# EAGLE design standalone_1_bit_logic (EAGLE 8.2.1)
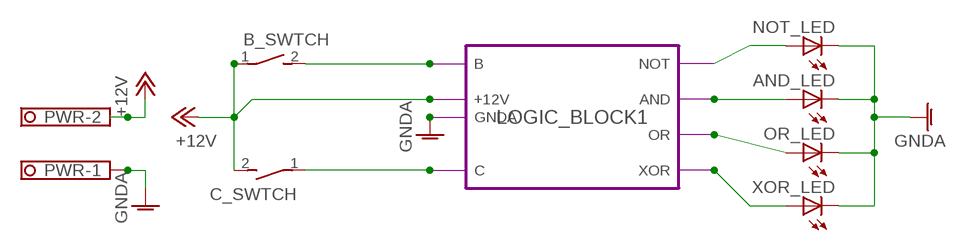
[diagram p0: schematic, sheet 1]

## Parts
AND_LED  LED3MM  [LED3MM]
B_SWTCH  SWTCH_BLCK  [1751248]
C_SWTCH  SWTCH_BLCK  [1751248]
NOT_LED  LED3MM  [LED3MM]
OR_LED  LED3MM  [LED3MM]
PWR  1751248  [1751248]
XOR_LED  LED3MM  [LED3MM]

## Module instances
LOGIC_BLOCK1 = LOGIC_BLOCK

## Nets
+12V: B_SWTCH.1(P) C_SWTCH.2(S) PWR.2 ; port LOGIC_BLOCK1.+12V
AND: AND_LED.A ; port LOGIC_BLOCK1.AND
B: B_SWTCH.2(S) ; port LOGIC_BLOCK1.B
C: C_SWTCH.1(P) ; port LOGIC_BLOCK1.C
GNDA: AND_LED.K(C) NOT_LED.K(C) OR_LED.K(C) PWR.1 XOR_LED.K(C) ; port LOGIC_BLOCK1.GNDA
NOT: NOT_LED.A ; port LOGIC_BLOCK1.NOT
OR: OR_LED.A ; port LOGIC_BLOCK1.OR
XOR: XOR_LED.A ; port LOGIC_BLOCK1.XOR

## Library data of the parts
AND_LED NOT_LED OR_LED XOR_LED = led:LED: LED OSRAM: - CHIPLED LG R971, LG N971, LY N971, LG Q971, LY Q971, LO R971, LY R971 LH N974, LH R974 LS Q976, LO Q976, LY Q976 LO Q996 - Hyper CHIPLED LW Q18S LB Q993, LB Q99A, LB R99A - SideLED LS A670, LO A670, LY A670, LG A670, LP A670 LB A673, LV A673, LT A673, LW A673 LH A674 LY A675 LS A676, LA A676, LO A676, LY A676, LW A676 LS A679, LY A679, LG A679 - Hyper Micro SIDELED® LS Y876, LA Y876, LO Y876, LY Y876 LT Y87S - SmartLED LW L88C, LW L88S LB L89C, LB L89S, LG L890 LS L89K, LO L89K, LY L89K LS L896, LA L896, LO L896, LY L896 - TOPLED LS T670, LO T670, LY T670, LG T670, LP T670 LSG T670, LSP T670, LSY T670, LOP T670, LYG T670 LG T671, LOG T671, LSG T671 LB T673, LV T673, LT T673, LW T673 LH T674 LS T676, LA T676, LO T676, LY T676, LB T676, LH T676, LSB T676, LW T676 LB T67C, LV T67C, LT T67C, LS T67K, LO T67K, LY T67K, LW E67C LS E67B, LA E67B, LO E67B, LY E67B, LB E67C, LV E67C, LT E67C LW T67C LS T679, LY T679, LG T679 LS T770, LO T770, LY T770, LG T770, LP T770 LB T773, LV T773, LT T773, LW T773 LH T774 LS E675, LA E675, LY E675, LS T675 LS T776, LA T776, LO T776, LY T776, LB T776 LHGB T686 LT T68C, LB T68C - Hyper Mini TOPLED® LB M676 - Mini TOPLED Santana® LG M470 LS M47K, LO M47K, LY M47K Source: http://www.osram.convergy.de LUXEON: - LUMILED® LXK2-PW12-R00, LXK2-PW12-S00, LXK2-PW14-U00, LXK2-PW14-V00 LXK2-PM12-R00, LXK2-PM12-S00, LXK2-PM14-U00 LXK2-PE12-Q00, LXK2-PE12-R00, LXK2-PE12-S00, LXK2-PE14-T00, LXK2-PE14-U00 LXK2-PB12-K00, LXK2-PB12-L00, LXK2-PB12-M00, LXK2-PB14-N00, LXK2-PB14-P00, LXK2-PB14-Q00 LXK2-PR12-L00, LXK2-PR12-M00, LXK2-PR14-Q00, LXK2-PR14-R00 LXK2-PD12-Q00, LXK2-PD12-R00, LXK2-PD12-S00 LXK2-PH12-R00, LXK2-PH12-S00 LXK2-PL12-P00, LXK2-PL12-Q00, LXK2-PL12-R00 Source: www.luxeon.com KINGBRIGHT: KA-3528ASYC Source: www.kingbright.com
B_SWTCH C_SWTCH = relay_computer_custom:SWTCH_BLCK: A symbolic switch, that really is backed by a 2 position terminal block; OC_FARNELL: unknown; OC_NEWARK: unknown
PWR = relay_computer_custom:1751248: MKDS 1/ 2-3,5 Printklemme Nennstrom: 10 A Bemessungsspannung: 160 V Raster: 3,5 mm Polzahl: 2 Montageart: Löten Anschlussart: Schraubanschluss Anschlussrichtung vom Leiter zur Platine: 0° Source: http://eshop.phoenixcontact.com .. 1751248.pdf; OC_FARNELL: unknown; OC_NEWARK: unknown

## Module LOGIC_BLOCK
Ports: NOT(out) AND(out) OR(out) XOR(out) +12V(pwr) GNDA(pwr) B(in) C(in)
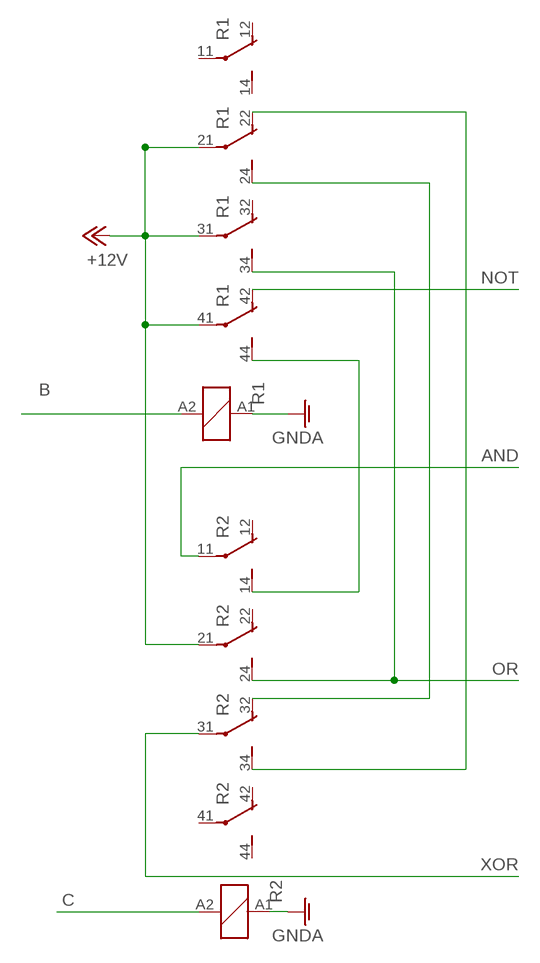
[diagram p1: schematic, module LOGIC_BLOCK, sheet 1]

### Parts
R1  PT571R06  [PT-4]
R2  PT571R06  [PT-4]

### Nets
+12V: R1.21(3:P) R1.31(4:P) R1.41(5:P) R2.21(3:P)
AND: R2.11(2:P)
B: R1.A2
C: R2.A2
GNDA: R1.A1 R2.A1
N$1: R1.24(3:S) R2.32(4:O)
N$2: R1.44(5:S) R2.14(2:S)
N$3: R1.22(3:O) R2.34(4:S)
NOT: R1.42(5:O)
OR: R1.34(4:S) R2.24(3:S)
XOR: R2.31(4:P)
Unconnected: R1.11(2:P) R1.12(2:O) R1.14(2:S) R1.32(4:O) R2.12(2:O) R2.22(3:O) R2.41(5:P) R2.42(5:O) R2.44(5:S)

### Library data of the parts
R1 R2 = relay_computer_custom:PT5*: Miniature Relay SCHRACK 2 pole 12 A, 3 pole 10 A or 4 pole 6 A DC- or AC-coil Source: http://www.schrack.com/.. 5823.pdf Socked 78604 Source: http://www.schrack.com/.. 5836.pdf; OC_FARNELL: unknown; OC_NEWARK: unknown

## Net classes
1 12V: width 0.203 mm
2 GNDA: width 0.203 mm

## Board
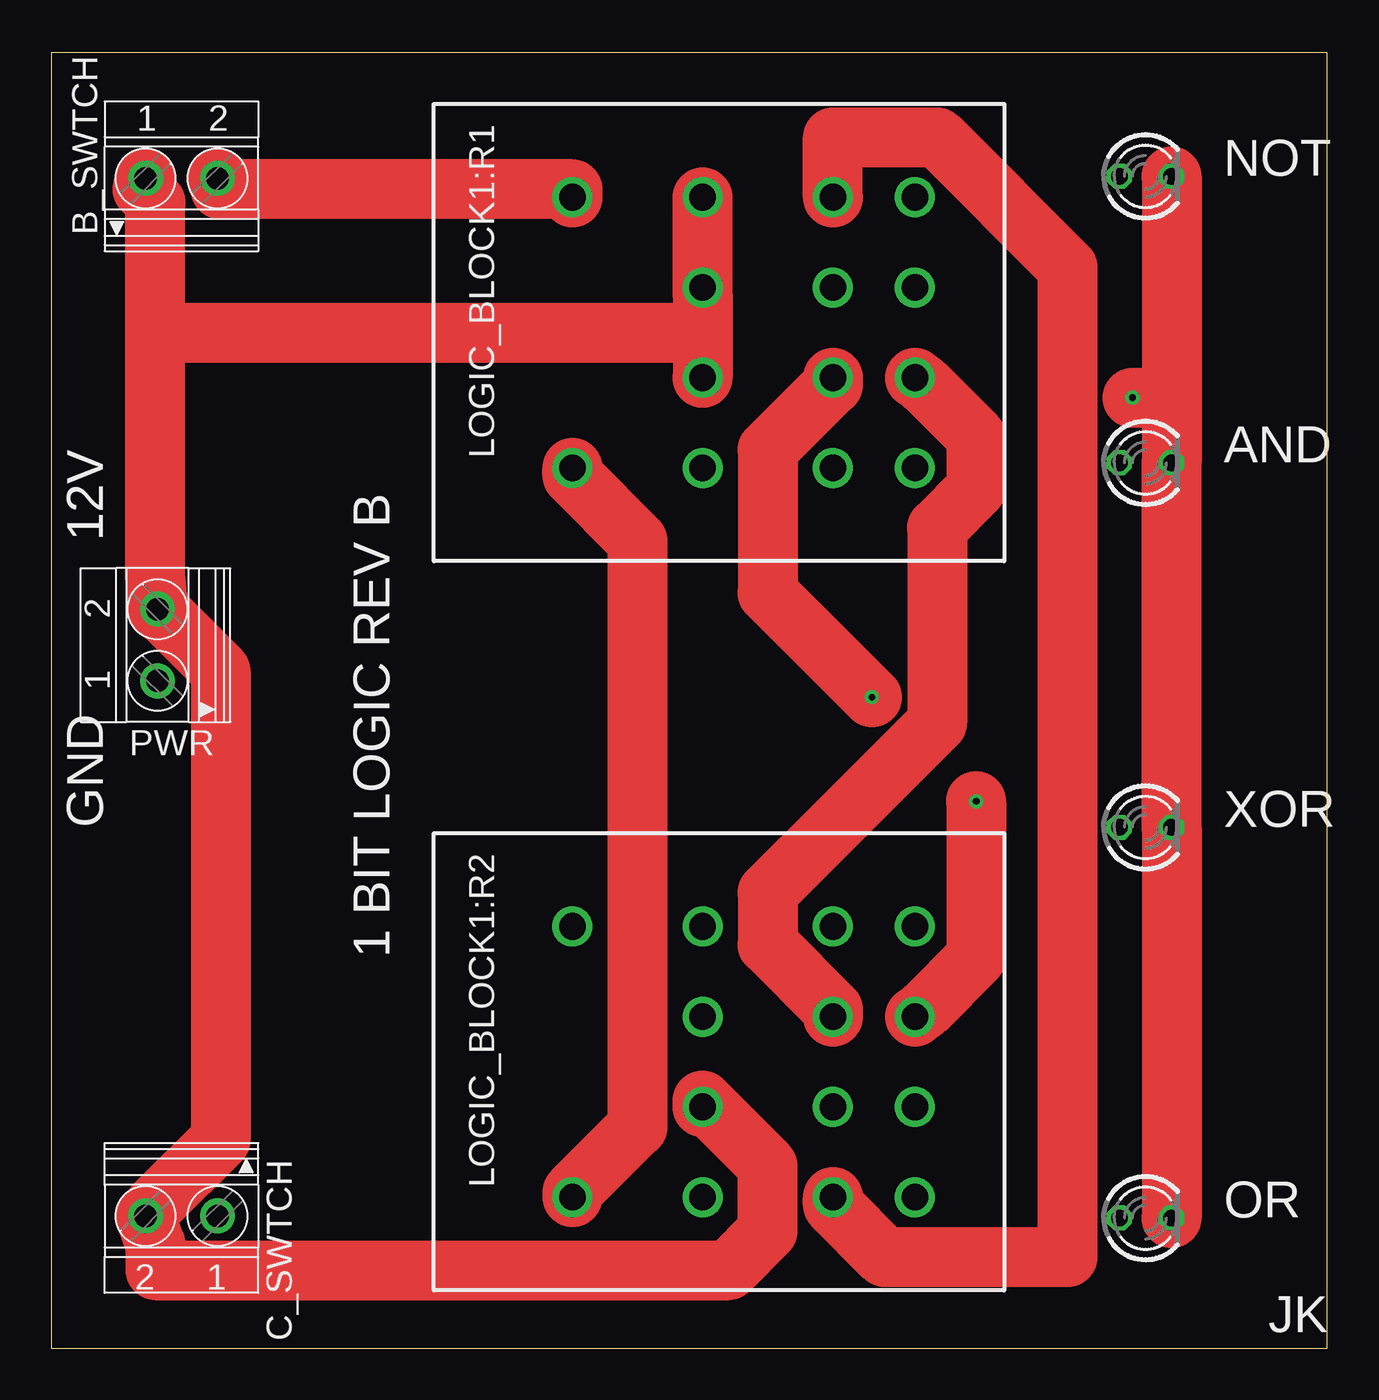
[diagram p2: board, top side]
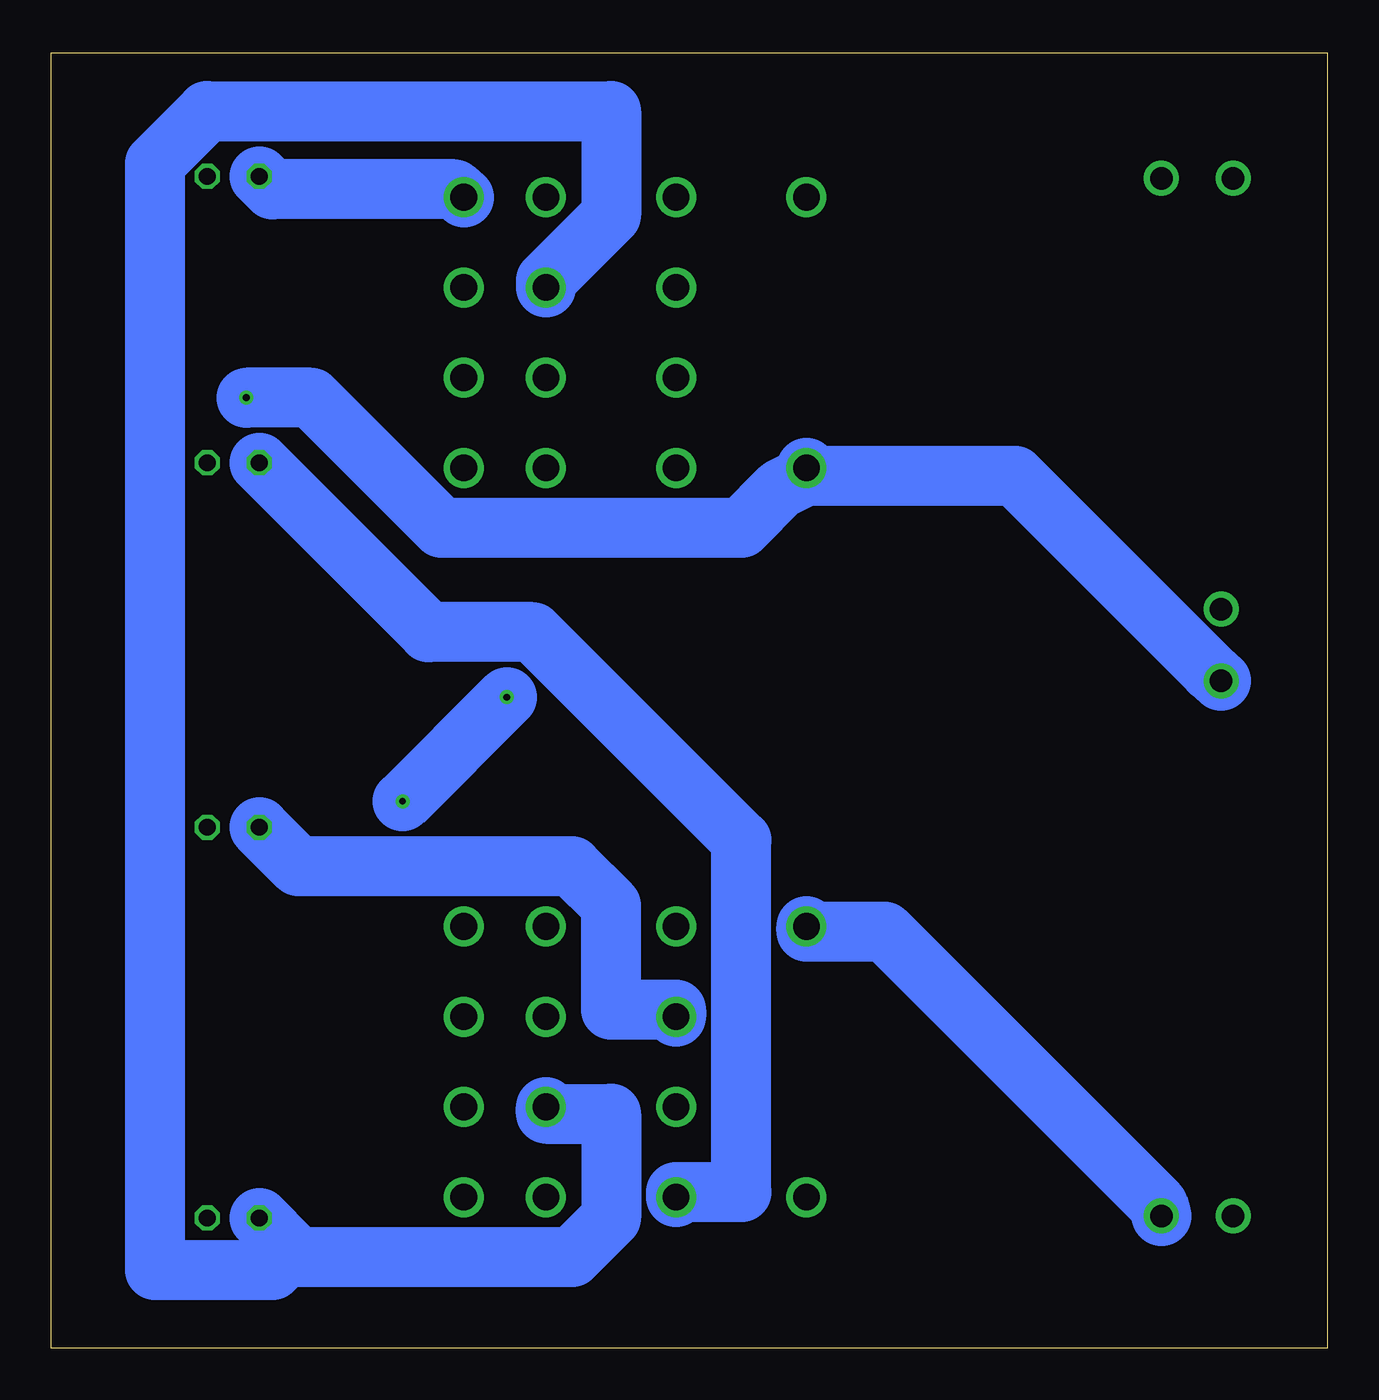
[diagram p3: board, bottom side, seen from below]

Size 62.21 x 63.17 mm. Coordinates in mm from the lower left corner, seen from the top.
Outline: 0,0 62.21,0 62.21,63.17 0,63.17 0,0
Copper layers (1*16): Top 0.07mm / dielectric 30mil / Bottom 0.07mm
Design rules "OSH_PARK_RULES_custom": minimum track width 115mil, minimum drill 13mil, track to track 6mil, track to pad 6mil, pad to pad 6mil, via to via 6mil, smd to smd 6mil, copper to edge 15mil, drill to drill 6mil, minimum pad ring 7mil, minimum via ring 7mil, stop-mask expansion 3mil, vias tented up to drill 0mil, thermal gap 10mil

### Footprints (pad centres in the part's own frame; a part is rotated, then mirrored left to right if it is on the bottom)
LED3MM = drill 0.813 octagon: A -1.27,0; K 1.27,0
1751248 = drill 1.1 pad 1.7: 1 -1.75,-0.1; 2 1.75,-0.1
PT-4 = drill 1.3: 11 6.6,6.35; 12 6.6,16.7; 14 6.6,12.7; 21 2.2,6.35; 22 2.2,16.7; 24 2.2,12.7; 31 -2.2,6.35; 32 -2.2,16.7; 34 -2.2,12.7; 41 -6.6,6.35; 42 -6.6,16.7; 44 -6.6,12.7; A1 6.6,0; A2 -6.6,0

### Placement (x,y rotation side)
AND_LED  53.34,43.18 0 top
B_SWTCH  6.35,57.15 0 top
C_SWTCH  6.35,6.35 180 top
LOGIC_BLOCK1:R1  PT571R06  [PT-4]  25.4,49.53 270 top
LOGIC_BLOCK1:R2  PT571R06  [PT-4]  25.4,13.97 270 top
NOT_LED  53.34,57.15 0 top
OR_LED  53.34,6.35 0 top
PWR  5.08,34.29 90 top
XOR_LED  53.34,25.4 0 top

### Tracks (layer width: path | path; a pad name or v marks a point on that pad's centre or on a via)
+12V
  Top 2.921: 31.75,49.53 31.75,51.44 LOGIC_BLOCK1:R1.31 LOGIC_BLOCK1:R1.41 | 31.75,49.53 LOGIC_BLOCK1:R1.21 | 5.08,49.53 5.08,37.47 PWR.2 5.71,35.56 8.26,33.02 8.26,10.16 5.08,6.99 C_SWTCH.2 5.08,5.08 5.08,3.81 33.02,3.81 34.92,5.71 34.92,8.89 31.75,12.06 LOGIC_BLOCK1:R2.21 | 5.08,49.53 5.08,55.88 4.45,56.52 B_SWTCH.1 | 5.08,49.53 31.75,49.53
AND
  Bottom 2.921: AND_LED.A 43.81,34.92 38.73,34.92 28.57,24.77 28.57,7.62 31.75,7.62 LOGIC_BLOCK1:R2.11
B
  Top 2.921: B_SWTCH.2 8.26,56.52 25.4,56.52 LOGIC_BLOCK1:R1.A2
C
  Bottom 2.921: C_SWTCH.1 8.26,6.99 21.59,20.32 25.4,20.32 LOGIC_BLOCK1:R2.A2
GNDA  (via drill 0.33)
  Top 2.921: NOT_LED.K 54.61,46.35 | 54.61,46.35 AND_LED.K XOR_LED.K OR_LED.K | LOGIC_BLOCK1:R2.A1 25.4,7.62 28.57,10.79 28.57,39.37 25.4,42.55 LOGIC_BLOCK1:R1.A1 | v52.7,46.35 54.61,46.35
  Bottom 2.921: 25.4,42.55 15.24,42.55 5.71,33.02 PWR.1 | 25.4,42.55 LOGIC_BLOCK1:R1.A1 | v52.7,46.35 49.53,46.35 43.18,40.01 28.57,40.01 26.67,41.91 25.4,42.55
LOGIC_BLOCK1:N$1  (via drill 0.33)
  Top 2.921: v45.09,26.67 45.09,19.05 42.55,16.51 LOGIC_BLOCK1:R2.32 | v40.01,31.75 34.92,36.83 34.92,43.81 38.1,46.99 LOGIC_BLOCK1:R1.24
  Bottom 2.921: v40.01,31.75 v45.09,26.67
LOGIC_BLOCK1:N$2
  Top 2.921: LOGIC_BLOCK1:R1.44 38.1,59.05 43.18,59.05 49.53,52.7 49.53,4.45 40.64,4.45 38.1,6.99 LOGIC_BLOCK1:R2.14
LOGIC_BLOCK1:N$3
  Top 2.921: LOGIC_BLOCK1:R2.34 38.1,16.51 34.92,19.68 34.92,22.23 43.18,30.48 43.18,40.01 45.09,41.91 45.09,44.45 42.55,46.99 LOGIC_BLOCK1:R1.22
NOT
  Bottom 2.921: NOT_LED.A 51.44,56.52 42.55,56.52 LOGIC_BLOCK1:R1.42
OR
  Bottom 2.921: 50.48,4.76 50.16,4.45 36.83,4.45 34.92,6.35 34.92,11.43 38.1,11.43 LOGIC_BLOCK1:R2.24 | 50.48,4.76 OR_LED.A | LOGIC_BLOCK1:R1.34 38.1,52.07 34.92,55.24 34.92,60.33 54.61,60.33 57.15,57.78 57.15,3.81 51.44,3.81 50.48,4.76
XOR
  Bottom 2.921: XOR_LED.A 50.16,23.5 36.83,23.5 34.92,21.59 34.92,16.51 31.75,16.51 LOGIC_BLOCK1:R2.31

### Text on the board
tNames: NOT | AND | 12V | GND | XOR | 1 BIT LOGIC REV B | OR | JK